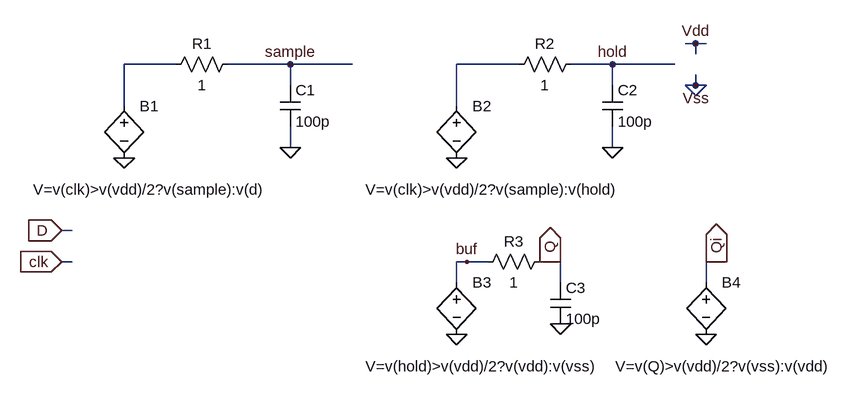
[diagram p0: schematic dfft.asc]
dfft.asc, the LTspice schematic file:
Version 4
SHEET 1 6308 700
WIRE 1584 -736 1568 -736
WIRE 1600 -736 1584 -736
WIRE 1584 -720 1584 -736
WIRE 784 -704 704 -704
WIRE 960 -704 864 -704
WIRE 1056 -704 960 -704
WIRE 1312 -704 1216 -704
WIRE 1456 -704 1392 -704
WIRE 1552 -704 1456 -704
WIRE 960 -672 960 -704
WIRE 1456 -672 1456 -704
WIRE 1584 -672 1584 -688
WIRE 1584 -672 1568 -672
WIRE 1600 -672 1584 -672
WIRE 1584 -656 1568 -672
WIRE 1584 -656 1600 -672
WIRE 704 -640 704 -704
WIRE 1216 -640 1216 -704
WIRE 960 -576 960 -608
WIRE 1456 -576 1456 -608
WIRE 624 -448 608 -448
WIRE 624 -400 608 -400
WIRE 1232 -400 1216 -400
WIRE 1264 -400 1232 -400
WIRE 1360 -400 1344 -400
WIRE 1376 -400 1360 -400
WIRE 1616 -400 1600 -400
WIRE 1632 -400 1616 -400
WIRE 1216 -368 1216 -400
WIRE 1376 -368 1376 -400
WIRE 1600 -368 1600 -400
FLAG 608 -448 D
IOPIN 608 -448 In
FLAG 1456 -704 hold
FLAG 1360 -400 Q
IOPIN 1360 -400 Out
FLAG 960 -704 sample
FLAG 1584 -736 Vdd
FLAG 1584 -672 Vss
FLAG 704 -560 0
FLAG 608 -400 clk
IOPIN 608 -400 In
FLAG 1216 -560 0
FLAG 1216 -288 0
FLAG 1616 -400 Qi
IOPIN 1616 -400 Out
FLAG 1600 -288 0
FLAG 1376 -304 0
FLAG 1232 -400 buf
FLAG 960 -576 0
FLAG 1456 -576 0
SYMBOL cap 944 -672 R0
SYMATTR InstName C1
SYMATTR Value 100p
SYMBOL cap 1440 -672 R0
SYMATTR InstName C2
SYMATTR Value 100p
SYMBOL bv 704 -656 R0
WINDOW 3 -140 145 Left 0
SYMATTR Value V=v(clk)>v(vdd)/2?v(sample):v(d)
SYMATTR InstName B1
SYMBOL res 880 -720 R90
WINDOW 0 0 56 VBottom 0
WINDOW 3 32 56 VTop 0
SYMATTR InstName R1
SYMATTR Value 1
SYMBOL bv 1216 -656 R0
WINDOW 3 -140 145 Left 0
SYMATTR Value V=v(clk)>v(vdd)/2?v(sample):v(hold)
SYMATTR InstName B2
SYMBOL res 1408 -720 R90
WINDOW 0 0 56 VBottom 0
WINDOW 3 32 56 VTop 0
SYMATTR InstName R2
SYMATTR Value 1
SYMBOL bv 1216 -384 R0
WINDOW 3 -140 145 Left 0
SYMATTR Value V=v(hold)>v(vdd)/2?v(vdd):v(vss)
SYMATTR InstName B3
SYMBOL bv 1600 -384 R0
WINDOW 3 -140 145 Left 0
SYMATTR Value V=v(Q)>v(vdd)/2?v(vss):v(vdd)
SYMATTR InstName B4
SYMBOL res 1360 -416 R90
WINDOW 0 0 56 VBottom 0
WINDOW 3 32 56 VTop 0
SYMATTR InstName R3
SYMATTR Value 1
SYMBOL cap 1360 -368 R0
SYMATTR InstName C3
SYMATTR Value 100p

The netlist it stands for:
* dfft.asc
C1 sample 0 100p
C2 hold 0 100p
B1 N001 0 V=v(clk)>v(vdd)/2?v(sample):v(d)
R1 sample N001 1
B2 N002 0 V=v(clk)>v(vdd)/2?v(sample):v(hold)
R2 hold N002 1
B3 buf 0 V=v(hold)>v(vdd)/2?v(vdd):v(vss)
B4 Qi 0 V=v(Q)>v(vdd)/2?v(vss):v(vdd)
R3 Q buf 1
C3 Q 0 100p
.backanno
.end